# Altium schematic sheet MCU.SchDoc
size A4; DrawnBy: Emile Renaud; Revision: V1.0; SheetNumber: 1; SheetTotal: 2
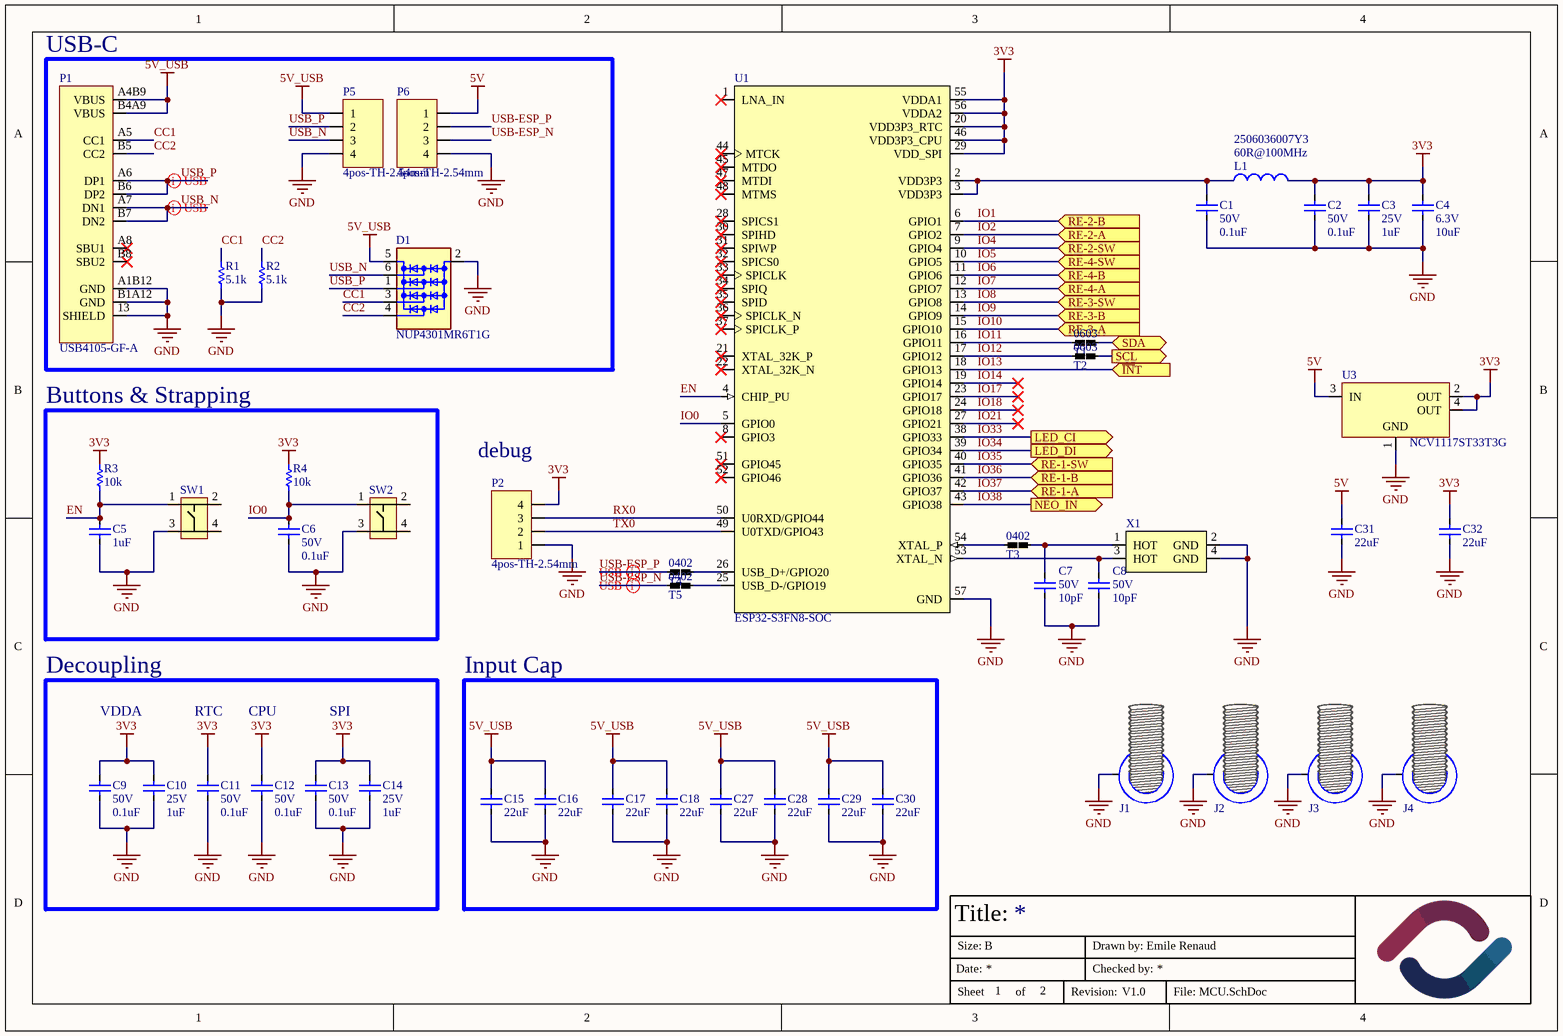
[diagram p0: MCU.SchDoc]

## Parts
C1  value 0.1uF  Volt: 50V  [CAPACITOR-0603]  (hidden comment: Capacitor-0603-0.1uF-50V-X7R)
C2  value 0.1uF  Volt: 50V  [CAPACITOR-0603]  (hidden comment: Capacitor-0603-0.1uF-50V-X7R)
C3  value 1uF  Volt: 25V  [CAPACITOR-0603]  (hidden comment: Capacitor-0603-1uF-25V-X5R)
C4  value 10uF  Volt: 6.3V  [CAPACITOR-0603]  (hidden comment: Capacitor-0603-10uF-6.3V-X5R)
C5  value 1uF  [CAPACITOR-0603]  (hidden comment: Capacitor-0603-1uF-25V-X5R)
C6  value 0.1uF  Volt: 50V  [CAPACITOR-0603]  (hidden comment: Capacitor-0603-0.1uF-50V-X7R)
C7  value 10pF  Volt: 50V  [CAPACITOR-0402]  (hidden comment: Capacitor-0402-10pF-50V-C0G)
C8  value 10pF  Volt: 50V  [CAPACITOR-0402]  (hidden comment: Capacitor-0402-10pF-50V-C0G)
C9  value 0.1uF  Volt: 50V  [CAPACITOR-0603]  (hidden comment: Capacitor-0603-0.1uF-50V-X7R)
C10  value 1uF  Volt: 25V  [CAPACITOR-0603]  (hidden comment: Capacitor-0603-1uF-25V-X5R)
C11  value 0.1uF  Volt: 50V  [CAPACITOR-0603]  (hidden comment: Capacitor-0603-0.1uF-50V-X7R)
C12  value 0.1uF  Volt: 50V  [CAPACITOR-0603]  (hidden comment: Capacitor-0603-0.1uF-50V-X7R)
C13  value 0.1uF  Volt: 50V  [CAPACITOR-0603]  (hidden comment: Capacitor-0603-0.1uF-50V-X7R)
C14  value 1uF  Volt: 25V  [CAPACITOR-0603]  (hidden comment: Capacitor-0603-1uF-25V-X5R)
C15  value 22uF  [CAPACITOR-0805]  (hidden comment: Capacitor-0805-22uF-16V-X5R)
C16  value 22uF  [CAPACITOR-0805]  (hidden comment: Capacitor-0805-22uF-16V-X5R)
C17  value 22uF  [CAPACITOR-0805]  (hidden comment: Capacitor-0805-22uF-16V-X5R)
C18  value 22uF  [CAPACITOR-0805]  (hidden comment: Capacitor-0805-22uF-16V-X5R)
C27  value 22uF  [CAPACITOR-0805]  (hidden comment: Capacitor-0805-22uF-16V-X5R)
C28  value 22uF  [CAPACITOR-0805]  (hidden comment: Capacitor-0805-22uF-16V-X5R)
C29  value 22uF  [CAPACITOR-0805]  (hidden comment: Capacitor-0805-22uF-16V-X5R)
C30  value 22uF  [CAPACITOR-0805]  (hidden comment: Capacitor-0805-22uF-16V-X5R)
C31  value 22uF  [CAPACITOR-0805]  (hidden comment: Capacitor-0805-22uF-16V-X5R)
C32  value 22uF  [CAPACITOR-0805]  (hidden comment: Capacitor-0805-22uF-16V-X5R)
D1  NUP4301MR6T1G  [SOT-23-6]
J1  hole  [HOLE-3.40MM-M3-8MMEYELET]  (value not drawn)  (no BOM)
J2  hole  [HOLE-3.40MM-M3-8MMEYELET]  (value not drawn)  (no BOM)
J3  hole  [HOLE-3.40MM-M3-8MMEYELET]  (value not drawn)  (no BOM)
J4  hole  [HOLE-3.40MM-M3-8MMEYELET]  (value not drawn)  (no BOM)
L1  2506036007Y3  value 60R@100MHz  [CAPACITOR-0603]
P1  USB4105-GF-A  [USB-C]
P2  4pos-TH-2.54mm  [HDR1X4]
P5  4pos-TH-2.54mm  [HDR1X4]
P6  4pos-TH-2.54mm  [HDR1X4]
R1  value 5.1k  [RESISTOR-0603]  (hidden comment: Resistor-0603-5.1k)
R2  value 5.1k  [RESISTOR-0603]  (hidden comment: Resistor-0603-5.1k)
R3  value 10k  [Resistor-0603]  (hidden comment: SMT resistor)
R4  value 10k  [Resistor-0603]  (hidden comment: SMT resistor)
SW1  PTS815 SJM 250 SMTR LFS  [SW4_PTS815 SJM 250 SMTR LFS_CNK]  (value not drawn)
SW2  PTS815 SJM 250 SMTR LFS  [SW4_PTS815 SJM 250 SMTR LFS_CNK]  (value not drawn)
T1  NetTie_0603  [NetTie-0603-short]  (value not drawn)
T2  NetTie_0603  [NetTie-0603-short]  (value not drawn)
T3  NetTie_0402  [NetTie-0402]  (value not drawn)
T4  NetTie_0402  [NetTie-0402]  (value not drawn)
T5  NetTie_0402  [NetTie-0402]  (value not drawn)
U1  ESP32-S3FN8-SOC  [VFQFN-56 Exposed Pad]
U3  NCV1117ST33T3G  [SOT-223-3/TO-261-3S]
X1  CX2016DB40000D0FLJCC  [4-SMD]  (value not drawn)

## Blocks framed on the sheet
USB-C: D1 P1 P5 P6 R1 R2
Buttons & Strapping: C5 C6 R3 R4 SW1 SW2
Decoupling: C9-C14
Input Cap: C15-C18 C27-C30

## Ports
LED_CI (out), LED_DI (out), NEO_IN (out), RE-1-A (in), RE-1-B (in), RE-1-SW (in), RE-2-A (in), RE-2-B (in), RE-2-SW (in), RE-3-A (in), RE-3-B (in), RE-3-SW (in), RE-4-A (in), RE-4-B (in), RE-4-SW (in), SCL (out), SDA (bidir), ~{IN}T (in)

## Nets
3V3: C2.2 C3.2 C4.2 C9.2 C10.2 C11.2 C12.2 C13.2 C14.2 C32.2 L1.2 P2.4 R3.2 R4.2 U1.20(VDD3P3_RTC) U1.29(VDD_SPI) U1.46(VDD3P3_CPU) U1.55(VDDA1) U1.56(VDDA2) U3.2(OUT) U3.4(OUT)
5V: C31.2 P6.1 U3.3(IN)
5V_USB: C15.2 C16.2 C17.2 C18.2 C27.2 C28.2 C29.2 C30.2 D1.5(VDD) P1.A4B9(VBUS) P1.B4A9(VBUS) P5.1
GND: C1.1 C2.1 C3.1 C4.1 C5.1 C6.1 C7.1 C8.1 C9.1 C10.1 C11.1 C12.1 C13.1 C14.1 C15.1 C16.1 C17.1 C18.1 C27.1 C28.1 C29.1 C30.1 C31.1 C32.1 D1.2(GND) J1.1 J2.1 J3.1 J4.1 P1.13(SHIELD) P1.A1B12(GND) P1.B1A12(GND) P2.1 P5.4 P6.4 R1.1 R2.1 SW1.3 SW2.3 U1.57(GND) U3.1(GND) X1.2(GND) X1.4(GND)
CC1: D1.3(L3) P1.A5(CC1) R1.2
CC2: D1.4(L4) P1.B5(CC2) R2.2
EN: C5.2 R3.1 SW1.1 U1.4(CHIP_PU)
IO0: C6.2 R4.1 SW2.1 U1.5(GPIO0)
IO1: U1.6(GPIO1) ; port RE-2-B
IO2: U1.7(GPIO2) ; port RE-2-A
IO4: U1.9(GPIO4) ; port RE-2-SW
IO5: U1.10(GPIO5) ; port RE-4-SW
IO6: U1.11(GPIO6) ; port RE-4-B
IO7: U1.12(GPIO7) ; port RE-4-A
IO8: U1.13(GPIO8) ; port RE-3-SW
IO9: U1.14(GPIO9) ; port RE-3-B
IO10: U1.15(GPIO10) ; port RE-3-A
IO11: T1.2 U1.16(GPIO11)
IO12: T2.2 U1.17(GPIO12)
IO13: U1.18(GPIO13) ; port ~{IN}T
IO14: U1.19(GPIO14)
IO17: U1.23(GPIO17)
IO18: U1.24(GPIO18)
IO21: U1.27(GPIO21)
IO33: U1.38(GPIO33) ; port LED_CI
IO34: U1.39(GPIO34) ; port LED_DI
IO35: U1.40(GPIO35) ; port RE-1-SW
IO36: U1.41(GPIO36) ; port RE-1-B
IO37: U1.42(GPIO37) ; port RE-1-A
IO38: U1.43(GPIO38) ; port NEO_IN
RX0: P2.3 U1.50(U0RXD/GPIO44)
SCL: T2.1 ; port SCL
SDA: T1.1 ; port SDA
TX0: P2.2 U1.49(U0TXD/GPIO43)
USB-ESP_N: P6.3 T5.2
USB-ESP_P: P6.2 T4.2
USB_N: D1.6(L1) P1.A7(DN1) P1.B7(DN2) P5.3
USB_P: D1.1(L2) P1.A6(DP1) P1.B6(DP2) P5.2
NetC1_2: C1.2 L1.1 U1.2(VDD3P3) U1.3(VDD3P3)
NetC7_2: C7.2 T3.1 X1.1(HOT)
NetC8_2: C8.2 U1.53(XTAL_N) X1.3(HOT)
NetT3_2: T3.2 U1.54(XTAL_P)
NetT4_1: T4.1 U1.26(USB_D+/GPIO20)
NetT5_1: T5.1 U1.25(USB_D-/GPIO19)

Not connected (* = marked no-connect by the designer): P1 A8(SBU1)* B8(SBU2)*; SW1 2 4; SW2 2 4; U1 1(LNA_IN)* 8(GPIO3)* 21(XTAL_32K_P)* 22(XTAL_32K_N)* 28(SPICS1)* 30(SPIHD)* 31(SPIWP)* 32(SPICS0)* 33(SPICLK)* 34(SPIQ)* 35(SPID)* 36(SPICLK_N)* 37(SPICLK_P)* 44(MTCK)* 45(MTDO)* 47(MTDI)* 48(MTMS)* 51(GPIO45)* 52(GPIO46)*

## Layout directives
differential pair; differential pair class USB: USB-ESP_N, USB-ESP_P, USB_N, USB_P

## Notes on the sheet
- (near P2) debug
- VDDA
- RTC
- CPU
- SPI
- Title:
- Date:
- Size:
- B
- Drawn by:
- Checked by:
- Sheet
- of
- Revision:
- File:
- (in symbol NetTie_0402) 0402
- (in symbol NetTie_0603) 0603

## Library data of the parts
C1 C2 C6 C9 C11-C13 = Capacitor-0603-0.1uF-50V-X7R: Precision: X7R-10%; Package / Case: Metric 1608, EIA 0603; Mounted: Yes; Supplier 1: Digi-Key; Supplier Part Number 1: 1276-1935-2-ND; Supplier 2: Digi-Key; Supplier Part Number 2: 1276-1934-2-ND
C3 C10 C14 = Capacitor-0603-1uF-25V-X5R: Precision: X5R-10%; Package / Case: Metric 1608, EIA 0603; Mounted: Yes; Supplier 1: Digi-Key; Supplier Part Number 1: 1276-1859-2-ND; Supplier 2: Digi-Key; Supplier Part Number 2: 1276-1942-2-ND
C4 = Capacitor-0603-10uF-6.3V-X5R: Capacitor-0603-10uF-6.3V-X5R, Low ESR, Low ESL; Precision: X5R-20%; Supplier 1: Arrow Electronics; Supplier Part Number 1: NMC0603X5R106M6.3TRP4KF; Mounted: Yes; Package / Case: Metric 1608 , EIA 0603
C5 = Capacitor-0603-1uF-25V-X5R: Precision: X5R-10%; Volt: 25V; Package / Case: Metric 1608, EIA 0603; Mounted: Yes; Supplier 1: Digi-Key; Supplier Part Number 1: 1276-1859-2-ND; Supplier 2: Digi-Key; Supplier 3: Digi-Key; Supplier 4: Digi-Key; Supplier Part Number 2: 1276-1942-2-ND
C7 C8 = Capacitor-0402-10pF-50V-C0G: Precision: C0G - 10%; Package / Case: 0402 (1005 Metric); Mounted: Yes; Supplier 1: Digi-Key; Supplier Part Number 1: 399-C0402C100K5GAC7867CT-ND; Supplier 2: Digi-Key; HelpURL: https://connect.kemet.com:7667/gateway/IntelliData-ComponentDocumentation/1.0/download/datasheet/C0402C100K5GACTU
C15-C18 C27-C32 = Capacitor-0805-22uF-16V-X5R: Precision: X5R-10%; Volt: 16V; Package / Case: Metric 2012 , EIA 0805; Mounted: Yes; Supplier 1: Digi-Key; Supplier Part Number 1: 1276-6780-1-ND; Supplier 2: Digi-Key; Supplier 3: Digi-Key; Supplier 4: Digi-Key
D1 = NUP4301MR6T1G: 4CH Clamp Ipp Tvs Diode Surface Mount SOT23-6 (SC74); Volt: 70; Supplier 1: Digi-Key; Supplier Part Number 1: NUP4301MR6T1GOSTR-ND; Mounted: Yes; Package / Case: SOT23-6
J1-J4 = Hole 3.40mm M3-Eyelet: Hole for M3 Bolt with 8mm pad; Mounted: N/A
L1 = 2506036007Y3: 60 Ohms @ 100 MHz 1 Signal Line Ferrite Bead 0603 (1608 Metric) 3A 40mOhm; Supplier 1: Digi-Key; Mounted: Yes; Supplier Part Number 1: 1934-1396-1-ND; Package / Case: SMD; Current: 3A
P1 = USB4105-GF-A: CONN RCP USB2.0 TYP C 24P SMD RA / 5A; Supplier 1: Digikey; Supplier Part Number 1: 2073-USB4105-GF-ACT-ND; Mounted: Yes; Package / Case: SMD; Volt: N/A
P2 P5 P6 = 4pos-TH-2.54mm: 4pos TH 2.54mm Header; Supplier 1: Digi-Key; Supplier Part Number 1: N/A; Mounted: Yes; Package / Case: TH; Volt: N/A
R1 R2 = Resistor-0603-DNI: 0603 footprint DO NOT INSTALL; Mounted: Yes; Package/Case: Metric 1608 , EIA 0603
R3 R4 = Resistor0603-10k: Precision: 1%; Watt: 0.1W; Mounted: Yes; Package / Case: Metric 1608, EIA 0603; Supplier 2: Digi-Key; Supplier 4: Digi-Key; Supplier Part Number 2: RMCF0603FT10K0TR-ND; Supplier 1: Digi-Key; Supplier 3: Digi-Key; Supplier Part Number 1: 311-10.0KHRTR-ND
SW1 SW2 = PTS815 SJM 250 SMTR LFS: TACT 4.2 X 3.2, 2.5 MM H, 180GF,; Volt: 12V; Current: 0.05A; Supplier 1: Digi-Key; Supplier Part Number 1: CKN12215-1-ND; Mounted: Yes
U1 = ESP32-S3FN8-SOC: IC RF TxRx + MCU Bluetooth, WiFi 802.11b/g/n, Bluetooth v5.0 2.412GHz ~ 2.484GHz 56-VFQFN Exposed Pad; MF: Espressif Systems; Availability: In Stock; MP: ESP32-S3FN8; Package: 56-VFQFN Exposed Pad; DigiKey Link: https://www.digikey.ca/en/products/detail/espressif-systems/ESP32-S3FN8/15822446; HelpURL: https://www.espressif.com/sites/default/files/documentation/esp32-s3_datasheet_en.pdf; Supplier 1: Digikey; Supplier Part Number 1: 1965-ESP32-S3FN8-ND
U3 = NCV1117ST33T3G: IC REG LINEAR 3.3V 1A SOT223; Supplier 1: Digi-Key; Supplier Part Number 1: NCV1117ST33T3GOSCT-ND; Package / Case: SOT223; Mounted: Yes
X1 = CX2016DB40000D0FLJCC: 40 MHz ±10ppm Crystal 8pF 50 Ohms 4-SMD, No Lead; Supplier 1: Digikey; Supplier Part Number 1: 478-CX2016DB40000D0FLJCCCT-ND; Parameter 1: *